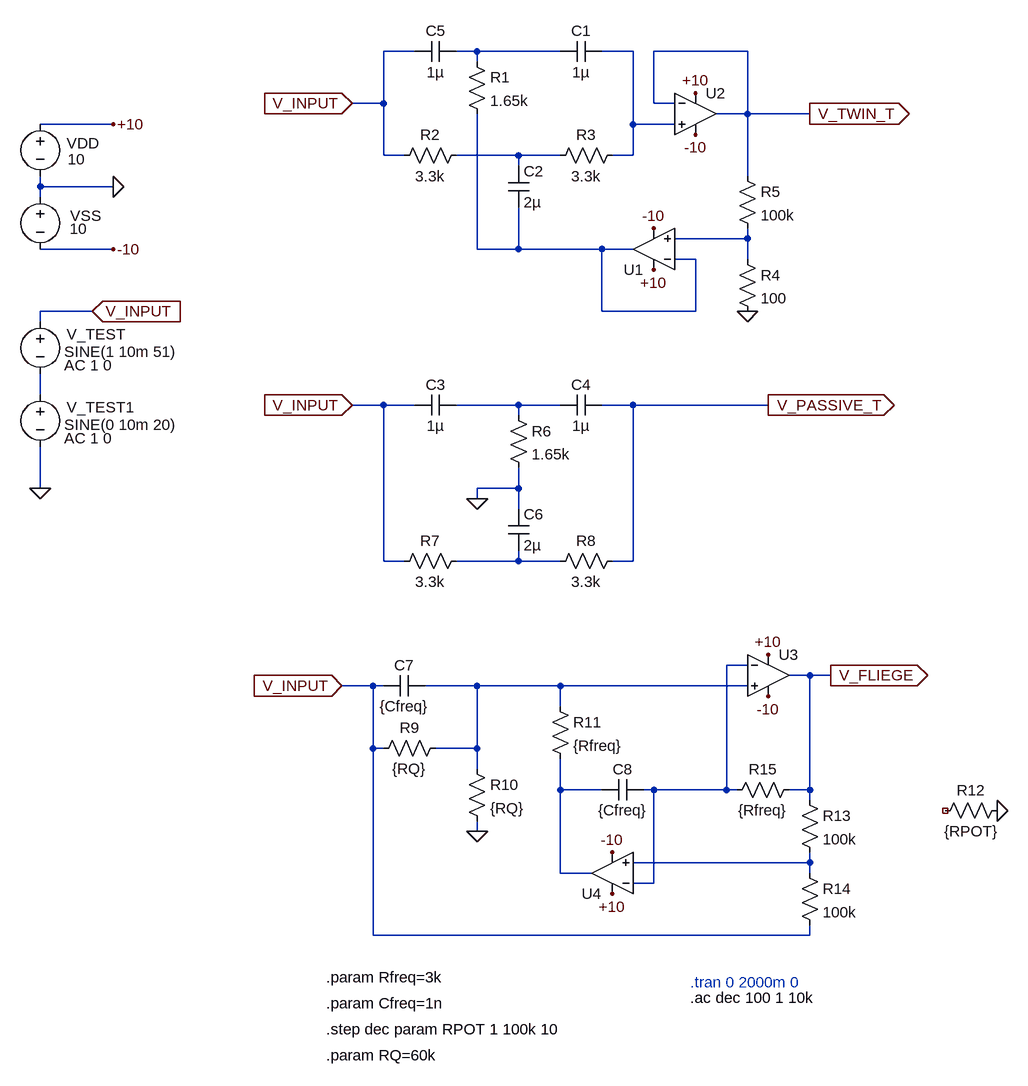
[diagram p0: schematic NOTCH2.asc]
NOTCH2.asc, the LTspice schematic file:
Version 4
SHEET 1 2296 1532
WIRE 880 -512 832 -512
WIRE 976 -512 944 -512
WIRE 1104 -512 976 -512
WIRE 1216 -512 1168 -512
WIRE 1392 -512 1248 -512
WIRE 976 -496 976 -512
WIRE 832 -432 832 -512
WIRE 832 -432 784 -432
WIRE 1248 -432 1248 -512
WIRE 1280 -432 1248 -432
WIRE 1392 -416 1392 -512
WIRE 1392 -416 1344 -416
WIRE 1488 -416 1392 -416
WIRE 416 -400 304 -400
WIRE 1216 -400 1216 -512
WIRE 1280 -400 1216 -400
WIRE 832 -352 832 -432
WIRE 864 -352 832 -352
WIRE 1040 -352 944 -352
WIRE 1104 -352 1040 -352
WIRE 1216 -352 1216 -400
WIRE 1216 -352 1184 -352
WIRE 1040 -336 1040 -352
WIRE 1392 -320 1392 -416
WIRE 304 -304 304 -320
WIRE 416 -304 304 -304
WIRE 304 -288 304 -304
WIRE 1392 -224 1392 -240
WIRE 1392 -224 1280 -224
WIRE 416 -208 304 -208
WIRE 976 -208 976 -416
WIRE 1040 -208 1040 -272
WIRE 1040 -208 976 -208
WIRE 1168 -208 1040 -208
WIRE 1216 -208 1168 -208
WIRE 1312 -192 1280 -192
WIRE 1392 -192 1392 -224
WIRE 384 -112 304 -112
WIRE 1168 -112 1168 -208
WIRE 1312 -112 1312 -192
WIRE 1312 -112 1168 -112
WIRE 304 -96 304 -112
WIRE 304 16 304 -16
WIRE 832 32 784 32
WIRE 880 32 832 32
WIRE 1040 32 944 32
WIRE 1104 32 1040 32
WIRE 1216 32 1168 32
WIRE 1424 32 1216 32
WIRE 1040 48 1040 32
WIRE 304 160 304 96
WIRE 1040 160 1040 128
WIRE 1040 160 976 160
WIRE 976 176 976 160
WIRE 1040 192 1040 160
WIRE 832 272 832 32
WIRE 864 272 832 272
WIRE 1040 272 1040 256
WIRE 1040 272 944 272
WIRE 1104 272 1040 272
WIRE 1216 272 1216 32
WIRE 1216 272 1184 272
WIRE 1392 432 1360 432
WIRE 1488 448 1456 448
WIRE 1520 448 1488 448
WIRE 816 464 768 464
WIRE 832 464 816 464
WIRE 976 464 896 464
WIRE 1104 464 976 464
WIRE 1392 464 1104 464
WIRE 1104 496 1104 464
WIRE 816 560 816 464
WIRE 832 560 816 560
WIRE 976 560 976 464
WIRE 976 560 912 560
WIRE 976 592 976 560
WIRE 1104 624 1104 576
WIRE 1168 624 1104 624
WIRE 1248 624 1232 624
WIRE 1360 624 1360 432
WIRE 1360 624 1248 624
WIRE 1376 624 1360 624
WIRE 1488 624 1488 448
WIRE 1488 624 1456 624
WIRE 1488 640 1488 624
WIRE 976 688 976 672
WIRE 1488 736 1488 720
WIRE 1488 736 1216 736
WIRE 1104 752 1104 624
WIRE 1152 752 1104 752
WIRE 1488 752 1488 736
WIRE 1248 768 1248 624
WIRE 1248 768 1216 768
WIRE 816 848 816 560
WIRE 1488 848 1488 832
WIRE 1488 848 816 848
FLAG 416 -400 +10
FLAG 416 -208 -10
FLAG 416 -304 0
FLAG 1488 -416 V_TWIN_T
IOPIN 1488 -416 Out
FLAG 384 -112 V_INPUT
IOPIN 384 -112 In
FLAG 1312 -448 +10
FLAG 1312 -384 -10
FLAG 784 -432 V_INPUT
IOPIN 784 -432 In
FLAG 1248 -176 +10
FLAG 1248 -240 -10
FLAG 1392 -112 0
FLAG 304 160 0
FLAG 784 32 V_INPUT
IOPIN 784 32 In
FLAG 976 176 0
FLAG 1424 32 V_PASSIVE_T
IOPIN 1424 32 Out
FLAG 768 464 V_INPUT
IOPIN 768 464 In
FLAG 976 688 0
FLAG 1424 416 +10
FLAG 1424 480 -10
FLAG 1184 784 +10
FLAG 1184 720 -10
FLAG 1520 448 V_FLIEGE
IOPIN 1520 448 Out
FLAG 1776 656 0
DATAFLAG 1552 -416 ""
SYMBOL voltage 304 -416 R0
WINDOW 0 41 45 Left 2
WINDOW 3 42 70 Left 2
WINDOW 123 0 0 Left 0
WINDOW 39 0 0 Left 0
SYMATTR InstName VDD
SYMATTR Value 10
SYMBOL voltage 304 -304 R0
WINDOW 0 46 45 Left 2
WINDOW 3 45 65 Left 2
WINDOW 123 0 0 Left 0
WINDOW 39 0 0 Left 0
SYMATTR InstName VSS
SYMATTR Value 10
SYMBOL voltage 304 -112 R0
WINDOW 0 41 35 Left 2
WINDOW 3 37 62 Left 2
WINDOW 123 37 83 Left 2
WINDOW 39 0 0 Left 0
SYMATTR InstName V_TEST
SYMATTR Value SINE(1 10m 51)
SYMATTR Value2 AC 1 0
SYMBOL cap 944 -528 R90
WINDOW 0 0 32 VBottom 2
WINDOW 3 32 32 VTop 2
SYMATTR InstName C5
SYMATTR Value 1µ
SYMBOL OpAmps\\UniversalOpAmp1 1312 -416 R0
SYMATTR InstName U2
SYMATTR Value2 Avol=205k GBW=4meg Vos=0
SYMBOL cap 1168 -528 R90
WINDOW 0 0 32 VBottom 2
WINDOW 3 32 32 VTop 2
SYMATTR InstName C1
SYMATTR Value 1µ
SYMBOL res 960 -512 R0
SYMATTR InstName R1
SYMATTR Value 1.65k
SYMBOL res 960 -368 R90
WINDOW 0 0 56 VBottom 2
WINDOW 3 32 56 VTop 2
SYMATTR InstName R2
SYMATTR Value 3.3k
SYMBOL res 1200 -368 R90
WINDOW 0 0 56 VBottom 2
WINDOW 3 32 56 VTop 2
SYMATTR InstName R3
SYMATTR Value 3.3k
SYMBOL cap 1024 -336 R0
SYMATTR InstName C2
SYMATTR Value 2µ
SYMBOL OpAmps\\UniversalOpAmp1 1248 -208 R180
SYMATTR InstName U1
SYMATTR Value2 Avol=205k GBW=4meg Vos=0
SYMBOL res 1376 -208 R0
SYMATTR InstName R4
SYMATTR Value 100
SYMBOL res 1376 -336 R0
SYMATTR InstName R5
SYMATTR Value 100k
SYMBOL voltage 304 0 R0
WINDOW 0 41 35 Left 2
WINDOW 3 37 62 Left 2
WINDOW 123 37 83 Left 2
WINDOW 39 0 0 Left 0
SYMATTR InstName V_TEST1
SYMATTR Value SINE(0 10m 20)
SYMATTR Value2 AC 1 0
SYMBOL cap 944 16 R90
WINDOW 0 0 32 VBottom 2
WINDOW 3 32 32 VTop 2
SYMATTR InstName C3
SYMATTR Value 1µ
SYMBOL cap 1168 16 R90
WINDOW 0 0 32 VBottom 2
WINDOW 3 32 32 VTop 2
SYMATTR InstName C4
SYMATTR Value 1µ
SYMBOL res 1024 32 R0
SYMATTR InstName R6
SYMATTR Value 1.65k
SYMBOL res 960 256 R90
WINDOW 0 0 56 VBottom 2
WINDOW 3 32 56 VTop 2
SYMATTR InstName R7
SYMATTR Value 3.3k
SYMBOL res 1200 256 R90
WINDOW 0 0 56 VBottom 2
WINDOW 3 32 56 VTop 2
SYMATTR InstName R8
SYMATTR Value 3.3k
SYMBOL cap 1024 192 R0
SYMATTR InstName C6
SYMATTR Value 2µ
SYMBOL cap 896 448 R90
WINDOW 0 0 32 VBottom 2
WINDOW 3 32 32 VTop 2
SYMATTR InstName C7
SYMATTR Value {Cfreq}
SYMBOL res 928 544 R90
WINDOW 0 0 56 VBottom 2
WINDOW 3 32 56 VTop 2
SYMATTR InstName R9
SYMATTR Value {RQ}
SYMBOL res 960 576 R0
SYMATTR InstName R10
SYMATTR Value {RQ}
SYMBOL res 1088 480 R0
SYMATTR InstName R11
SYMATTR Value {Rfreq}
SYMBOL OpAmps\\UniversalOpAmp1 1424 448 R0
SYMATTR InstName U3
SYMATTR Value2 Avol=205k GBW=4meg Vos=0
SYMBOL res 1792 640 R90
WINDOW 0 0 56 VBottom 2
WINDOW 3 32 56 VTop 2
SYMATTR InstName R12
SYMATTR Value {RPOT}
SYMBOL cap 1232 608 R90
WINDOW 0 0 32 VBottom 2
WINDOW 3 32 32 VTop 2
SYMATTR InstName C8
SYMATTR Value {Cfreq}
SYMBOL OpAmps\\UniversalOpAmp1 1184 752 R180
SYMATTR InstName U4
SYMATTR Value2 Avol=205k GBW=4meg Vos=0
SYMBOL res 1472 624 R0
SYMATTR InstName R13
SYMATTR Value 100k
SYMBOL res 1472 736 R0
SYMATTR InstName R14
SYMATTR Value 100k
SYMBOL res 1472 608 R90
WINDOW 0 0 56 VBottom 2
WINDOW 3 32 56 VTop 2
SYMATTR InstName R15
SYMATTR Value {Rfreq}
TEXT 1304 920 Left 2 ;.tran 0 2000m 0
TEXT 1304 944 Left 2 !.ac dec 100 1 10k
TEXT 744 912 Left 2 !.param Rfreq=3k
TEXT 744 952 Left 2 !.param Cfreq=1n
TEXT 744 992 Left 2 !.step dec param RPOT 1 100k 10
TEXT 744 1032 Left 2 !.param RQ=60k

The netlist it stands for:
* NOTCH2.asc
VDD +10 0 10
VSS 0 -10 10
V_TEST V_INPUT N006 SINE(1 10m 51) AC 1 0
C5 N001 V_INPUT 1µ
XU2 N002 V_TWIN_T +10 -10 V_TWIN_T level1 Avol=205k GBW=4meg Vos=0 En=0 Enk=0 In=0 Ink=0 Rin=500Meg  ; pins In+ In- V+ V- OUT
C1 N002 N001 1µ
R1 N001 N005 1.65k
R2 N003 V_INPUT 3.3k
R3 N002 N003 3.3k
C2 N003 N005 2µ
XU1 N004 N005 +10 -10 N005 level1 Avol=205k GBW=4meg Vos=0 En=0 Enk=0 In=0 Ink=0 Rin=500Meg  ; pins In+ In- V+ V- OUT
R4 N004 0 100
R5 V_TWIN_T N004 100k
V_TEST1 N006 0 SINE(0 10m 20) AC 1 0
C3 N007 V_INPUT 1µ
C4 V_PASSIVE_T N007 1µ
R6 N007 0 1.65k
R7 N008 V_INPUT 3.3k
R8 V_PASSIVE_T N008 3.3k
C6 0 N008 2µ
C7 N010 V_INPUT {Cfreq}
R9 N010 V_INPUT {RQ}
R10 N010 0 {RQ}
R11 N010 N011 {Rfreq}
XU3 N010 N009 +10 -10 V_FLIEGE level1 Avol=205k GBW=4meg Vos=0 En=0 Enk=0 In=0 Ink=0 Rin=500Meg  ; pins In+ In- V+ V- OUT
R12 0 NC_01 {RPOT}
C8 N009 N011 {Cfreq}
XU4 N012 N009 +10 -10 N011 level1 Avol=205k GBW=4meg Vos=0 En=0 Enk=0 In=0 Ink=0 Rin=500Meg  ; pins In+ In- V+ V- OUT
R13 V_FLIEGE N012 100k
R14 N012 V_INPUT 100k
R15 V_FLIEGE N009 {Rfreq}
* .tran 0 2000m 0
.ac dec 100 1 10k
.param Rfreq=3k
.param Cfreq=1n
.step dec param RPOT 1 100k 10
.param RQ=60k
.lib UniversalOpAmp1.lib
.backanno
.end